# EAGLE design v1.3 (EAGLE 9.5.1)
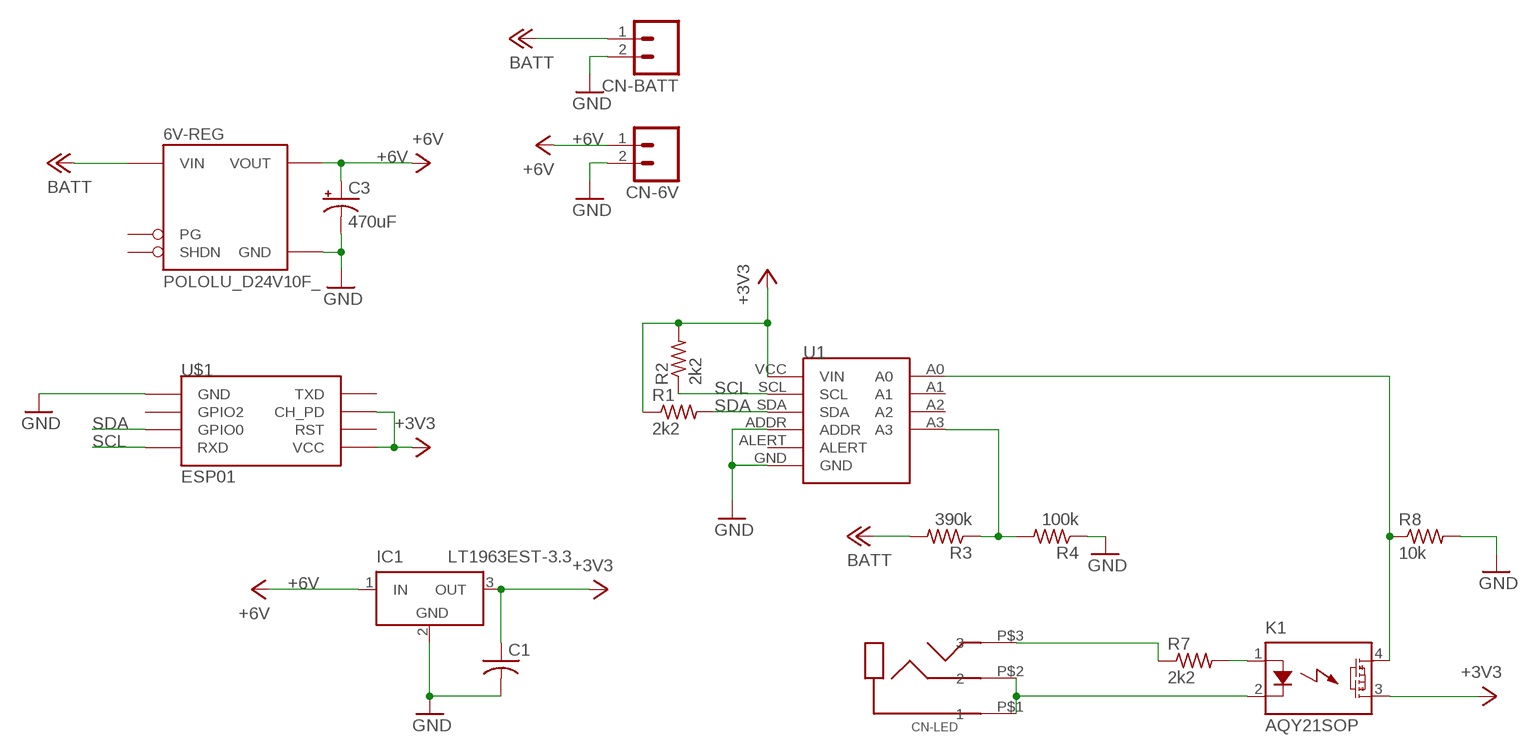
[diagram p0: schematic, sheet 1]

## Parts
6V-REG  POLOLU_D24V10F_  [POLOLU_D24V10]
C1  C-USC1210  [C1210]
C3  470uF  100UF-POLAR-RADIAL-2.5MM-25V-20%  [CPOL-RADIAL-2.5MM-6.5MM]
CN-6V  M02  [02P]
CN-BATT  M02  [02P]
CN-LED  PJ-320B  [PJ-320B]
IC1  LT1963EST-3.3  [SOT223]
K1  AQY21SOP  [SOP04]
R1  2k2  R-US_R0603  [R0603]
R2  2k2  R-US_R0603  [R0603]
R3  390k  R-US_R0603  [R0603]
R4  100k  R-US_R0603  [R0603]
R7  2k2  R-US_R0603  [R0603]
R8  10k  R-US_R0603  [R0603]
U1  GY-ADS1115THM  [GY-ADS1115-THM]
U$1  ESP01  [ESP01]

## Nets
+3V3: C1.1 IC1.3(OUT) K1.3(DS2) R1.1 R2.2 U1.VCC(VIN) U$1.CH_PD U$1.VCC
+6V: 6V-REG.VOUT C3.1(+) CN-6V.1 IC1.1(IN)
+12V: 6V-REG.VIN CN-BATT.1 R3.2 ; supply symbol labelled BATT
GND: 6V-REG.GND C1.2 C3.2(-) CN-6V.2 CN-BATT.2 IC1.2(GND) R4.1 R8.2 U1.ADDR U1.GND U$1.GND
N$1: K1.1(A) R7.2
N$2: R3.1 R4.2 U1.A3
N$4: CN-LED.P$3 R7.1
N$5: K1.4(DS1) R8.1 U1.A0
N$6: CN-LED.P$1 CN-LED.P$2 K1.2(K)
SCL: R2.1 U1.SCL U$1.RX(RXD)
SDA: R1.2 U1.SDA U$1.GPIO0
Unconnected: 6V-REG.PG 6V-REG.SHDN U1.A1 U1.A2 U1.ALERT U$1.GPIO2 U$1.RST U$1.TX(TXD)

## Power pins joined to a net without a drawn wire
GND: IC1.4(GND)

## Library data of the parts
6V-REG = _hhn_Pololu:POLOLU_D24V10F_
C1 = adafruit:C-US: CAPACITOR, American symbol
C3 = SparkFun-Capacitors:100UF-POLAR: 100µF polarized capacitors A capacitor is a passive two-terminal electrical component used to store electrical energy temporarily in an electric field.; PROD_ID: CAP-08439; VALUE: 100uF
CN-6V CN-BATT = con-amp-quick:M02: AMP QUICK CONNECTOR; OC_FARNELL: unknown; OC_NEWARK: unknown
CN-LED = serge:PJ-320B
IC1 = linear-technology:LT1963EST: 1.5A, Low Noise, Fast Transient Response LDO Regulator Source: http://www.linear.com/pc/downloadDocument.do?navId=H0,C3,P2222,D3148; MPN: LT1963EST-3.3; OC_FARNELL: 1501032; OC_NEWARK: 57M7546
K1 = relay:AQY*: PhotoMOS Relay NAiS Source: http://www.panasonic-electric-works.com/catalogues/downloads/photomos/ds_x615_en_aqz10_20.pdf; OC_FARNELL: unknown; OC_NEWARK: unknown
R1-R4 R7 R8 = adafruit:R-US_: RESISTOR, American symbol
U1 = serge:GY-ADS1115
U$1 = esp8266modules:ESP01: ESP8266 Wifi module 01

## Board
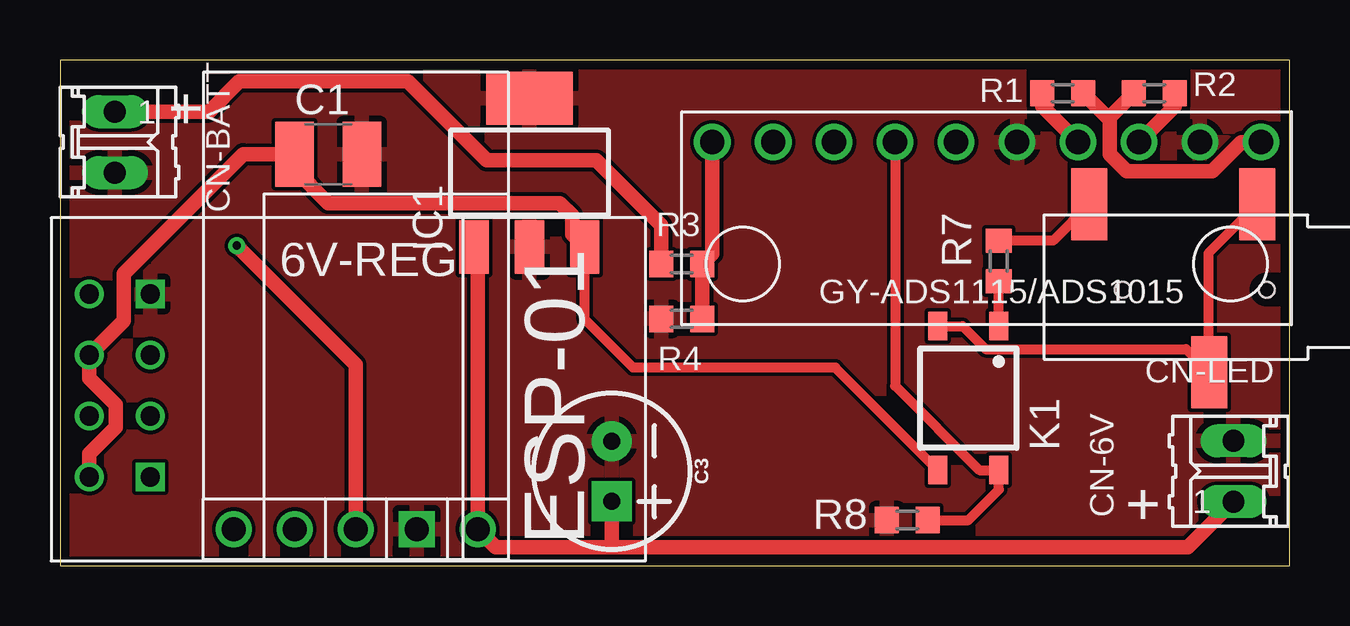
[diagram p1: board, top side]
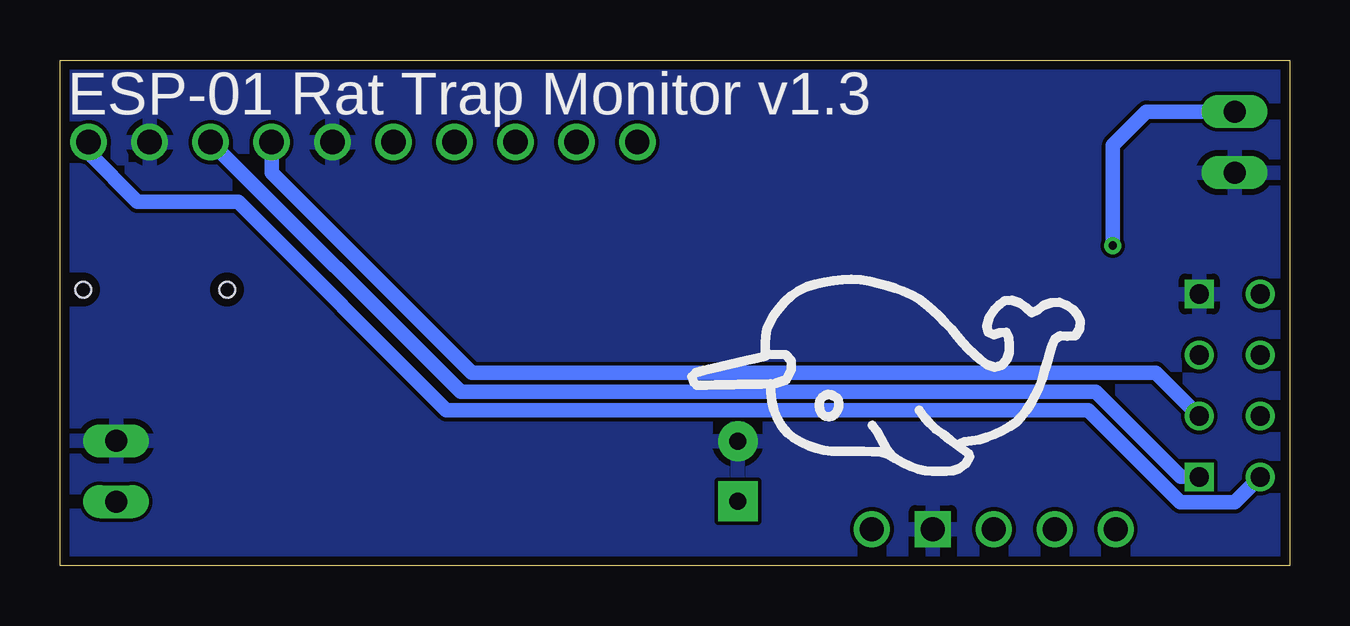
[diagram p2: board, bottom side, seen from below]

Size 51.23 x 21.07 mm. Coordinates in mm from the lower left corner, seen from the top.
Outline: 0,0 51.23,0 51.23,21.07 0,21.07 0,0
Copper layers (1*16): Top 0.0356mm / dielectric 1.5011mm / Bottom 0.0356mm
Design rules "LaenPCBOrder": minimum track width 6mil, minimum drill 13mil, track to track 6mil, track to pad 6mil, pad to pad 6mil, via to via 6mil, smd to smd 6mil, copper to edge 15mil, drill to drill 6mil, minimum pad ring 7mil, minimum via ring 7mil, stop-mask expansion 4mil, vias tented up to drill 0mil, thermal gap 10mil

### Footprints (pad centres in the part's own frame; a part is rotated, then mirrored left to right if it is on the bottom)
POLOLU_D24V10 = drill 1 square: GND 1.27,-5.715 | drill 1: PG -6.35,-5.715; SHDN -3.81,-5.715; VIN -1.27,-5.715; VOUT 3.81,-5.715
C1210 = smd 1.6 x 2.7: 1 -1.4,0; 2 1.4,0
CPOL-RADIAL-2.5MM-6.5MM = drill 0.7 pad 1.651 square: 1 1.25,0 | drill 0.7 pad 1.651: 2 -1.25,0
02P = drill 0.914 long: 1 -1.27,0; 2 1.27,0
PJ-320B = smd 1.5 x 3: P$1 -2.393,-3.5; P$2 -0.393,3.5; P$3 4.607,-3.5 | hole 0.65: -2.774,0.048; 3.226,0.048
SOT223 = smd 1.219 x 2.235: 1 -2.311,-3.099; 2 0,-3.099; 3 2.311,-3.099 | smd 3.6 x 2.2: 4 0,3.099
SOP04 = smd 0.8 x 1.2: 1 -1.27,-3; 2 1.27,-3; 3 1.27,3; 4 -1.27,3
R0603 = smd 1 x 1.1: 1 -0.85,0; 2 0.85,0
GY-ADS1115-THM = drill 1.016: A0 -3.81,0; A1 -6.35,0; A2 -8.89,0; A3 -11.43,0; ADDR 1.27,0; ALERT -1.27,0; GND 8.89,0; SCL 6.35,0; SDA 3.81,0; VCC 11.43,0
ESP01 = drill 0.8: CH_PD -1.285,-8.178; GPIO0 1.255,-5.638; GPIO2 -1.285,-5.638; RST 1.255,-8.178; TX -3.825,-8.178; VCC 3.795,-8.178 | drill 0.8 square: GND -3.825,-5.638; RX 3.795,-5.638

### Placement (x,y rotation side)
6V-REG  13.59,7.24 0 top
C1  11.18,17.14 0 top
C3  22.99,3.94 270 top
CN-6V  48.89,3.94 90 top
CN-BATT  2.29,17.65 270 top
CN-LED  47.5,11.56 180 top
IC1  19.56,16.38 0 top
K1  37.85,6.99 180 top
R1  41.78,19.68 180 top
R2  45.59,19.68 180 top
R3  25.91,12.57 180 top
R4  25.91,10.29 0 top
R7  39.12,12.7 270 top
R8  35.31,1.91 180 top
U1  38.61,17.65 0 top
U$1  9.4,7.49 270 top

### Tracks (layer width: path | path; a pad name or v marks a point on that pad's centre or on a via)
+3V3
  Top 0.406: K1.3 32.31,8.26 23.88,8.26 21.87,10.26 IC1.3
  Top 0.61: U$1.VCC 1.22,4.67 2.33,5.78 2.33,6.7 1.22,7.81 U$1.CH_PD 2.65,10.21 2.65,12.16 7.63,17.14 C1.1 9.78,16.51 11.18,15.11 20.83,15.11 21.34,14.61 21.34,13.82 IC1.3 | R1.1 43.74,18.58 | 43.74,18.58 43.74,17.15 44.45,16.43 48,16.43 49.22,17.65 U1.VCC | R2.2 43.74,18.68 43.74,18.58
  Bottom 0.61: U1.VCC 50.04,17.2 48,15.16 43.81,15.16 35.13,6.48 8.39,6.48 4.55,2.64 2.28,2.64 U$1.VCC
+6V
  Top 0.61: 22.99,0.76 46.99,0.76 CN-6V.1 | 22.99,0.76 18.16,0.76 6V-REG.VOUT 17.4,13.13 IC1.1 | C3.1 22.99,0.76
+12V  (via drill 0.35)
  Top 0.61: CN-BATT.1 6.21,18.92 7.48,20.19 14.48,20.19 17.78,16.89 22.35,16.89 25.06,14.19 R3.2 | 6V-REG.VIN 12.32,8.38 v7.37,13.34
  Bottom 0.61: CN-BATT.1 5.97,18.92 7.37,17.53 v7.37,13.34
GND
  pour Top: -1.52,-0.64 51.82,-0.64 51.82,21.59 -1.4,21.59 -1.52,21.46
  pour Bottom: -1.52,-0.64 -1.52,21.59 51.94,21.59 51.94,-0.64
N$1
  Top 0.406: K1.1 R7.2
N$2
  Top 0.61: U1.A3 27.18,12.99 R3.1 R4.2
N$4
  Top 0.406: CN-LED.P$3 41.38,13.55 R7.1
N$5
  Top 0.406: R8.1 37.85,1.91 39.12,3.17 K1.4 38.31,3.99 34.8,7.49 U1.A0
N$6
  Top 0.406: K1.2 37.61,9.98 38.57,9.03 46.92,9.03 47.85,8.1 | 47.85,8.1 CN-LED.P$2 | CN-LED.P$1 47.85,13.02 47.85,8.1
SCL
  Top 0.61: U1.SCL 46.44,19.14 R2.1
  Bottom 0.61: U1.SCL 34.54,7.24 8.07,7.24 4.53,3.7 U$1.RX
SDA
  Top 0.61: U1.SDA 40.93,19.14 R1.2
  Bottom 0.61: U1.SDA 42.42,16.38 34.08,8.05 5.57,8.05 U$1.GPIO0

### Text on the board
bPlace: ESP-01 Rat Trap Monitor v1.3
tNames: ⏚ + | + ⏚